# Altium schematic sheet battery_module.SchDoc
size A4
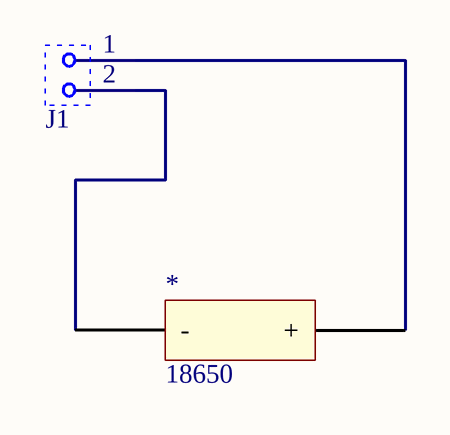
[diagram p0: battery_module.SchDoc]

## Parts
*  18650  [18650]
J1  Molex Microfit  [MICROFIT 1x2 Vertical]  (value not drawn)

## Nets
Net*_1: *.1(+) J1.1
Net*_2: *.2(-) J1.2

## Library data of the parts
* = 18650: Symbol: KEYSTONE 54; URL: https://www.tme.eu/pl/details/keys54/baterie-pojemniki-i-uchwyty/keystone/54/; Supplier: TME
J1 = Microfit 2x1: Symbol: Molex 430450212; Supplier: TME